# Altium schematic sheet PCB_Board4_schematic_2.SchDoc
size A; SheetNumber: 2; SheetTotal: 3
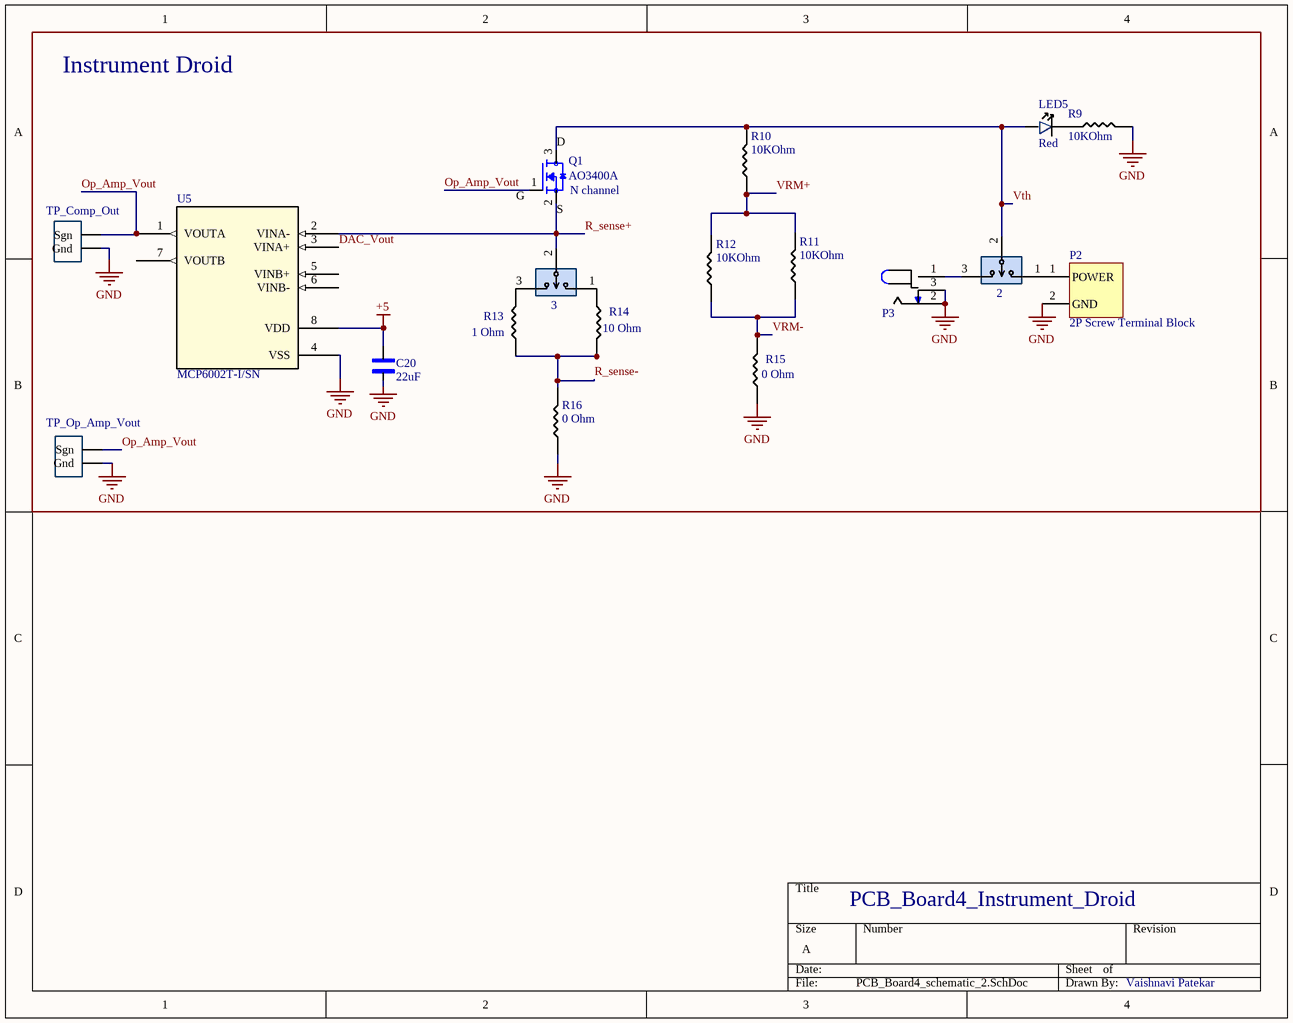
[diagram p0: PCB_Board4_schematic_2.SchDoc]

## Parts
2  PREC003SAAN-RC  [3_PIN_100mil]  (value not drawn)
3  PREC003SAAN-RC  [3_PIN_100mil]  (value not drawn)
C20  22uF  [1206_Passive_Capacitor]
LED5  Red  [LED_1206]
P2  2P Screw Terminal Block  [P_Terminal block 3.5mm-pitch]
P3  Power Jack  [Power_Jack]  (value not drawn)
Q1  AO3400A  value N channel  [N-MOSFET]
R9  value 10KOhm  [1206_Passive_Resitor]  (hidden comment: 10k)
R10  value 10KOhm  [1206_Passive_Resitor]  (hidden comment: 10k)
R11  value 10KOhm  [1206_Passive_Resitor]  (hidden comment: 10k)
R12  value 10KOhm  [1206_Passive_Resitor]  (hidden comment: 10k)
R13  1 Ohm  [1206_Passive_Resitor]
R14  10 Ohm  [1206_Passive_Resitor]
R15  0 Ohm  [1206_Passive_Resitor]
R16  0 Ohm  [1206_Passive_Resitor]
TP14  TP_Comp_Out  [TP10x_Probe]
TP15  TP_Op_Amp_Vout  [TP10x_Probe]
U5  MCP6002T-I/SN  [SOIC127P600X175-8N]

## Blocks framed on the sheet
Instrument Droid: 2 3 C20 LED5 P2 P3 Q1 R9-R16 TP14 TP15 U5

## Nets
+5: C20.1 U5.8(VDD)
GND: C20.2 P2.2(GND) P3.2 P3.3 R9.2 R15.1 R16.1 TP14.2(Gnd) TP15.2(Gnd) U5.4(VSS)
DAC_Vout: U5.3(VINA+)
Op_Amp_Vout: Q1.1(G) TP14.1(Sgn) TP15.1(Sgn) U5.1(VOUTA)
R_sense+: 3.2 Q1.2(S) U5.2(VINA-)
R_sense-: R13.1 R14.2 R16.2
VRM+: R10.1 R11.2 R12.2
VRM-: R11.1 R12.1 R15.2
Vth: 2.2 LED5.1 Q1.3(D) R10.2
Net2_1: 2.1 P2.1(POWER)
Net2_3: 2.3 P3.1
Net3_1: 3.1 R14.1
Net3_3: 3.3 R13.2
NetLED5_2: LED5.2 R9.1

Not connected (* = marked no-connect by the designer): U5 5(VINB+) 6(VINB-) 7(VOUTB)

## Notes on the sheet
- PCB_Board4_Instrument_Droid
- Vaishnavi Patekar

## Library data of the parts
2 3 = SW_3Pin_100mil_Switch: Connector Header Through Hole 3 position 0.100" (2.54mm); Value: CONN HEADER VERT 3POS 2.54MM; Digikey Link: https://www.digikey.com/product-detail/en/PREC003SAAN-RC/S1012EC-03-ND/2774851/?itemSeq=304982371; MFR Part #: PREC003SAAN-RC; Type: Extended; LCSC Part#: C49257
C20 = C_22uF_1206: 22uF ±10% 25V X5R 1206 Multilayer Ceramic Capacitors MLCC - SMD/SMT RoHS; MFR Part #: CL31A226KAHNNNE; Type: basic; LCSC Part#: C12891; Datasheet: https://datasheet.lcsc.com/lcsc/1811031514_Samsung-Electro-Mechanics-CL31A226KAHNNNE_C12891.pdf; Value: 22uF
LED5 = LED_RED_1206: Red 621~631nm 1206 Light Emitting Diodes (LED) RoHS; MFR Part #: 15-21/R6C-FQ1R1B/2T; Type: Extended; LCSC Part#: C93133; Datasheet: https://datasheet.lcsc.com/szlcsc/1811151241_Everlight-Elec-15-21-R6C-FQ1R1B-2T_C93133.pdf; Value: Red
P2 = P_Terminal block: Green Straight pin 3.5mm  pitch; P=3.5mm  Screw terminal ROHS; MFR Part #: KF350-3.5-2P; Manufacturer: Cixi Kefa Elec; LCSC Part#: C474892; DataSheet: https://datasheet.lcsc.com/lcsc/2001160007_Cixi-Kefa-Elec-KF350-3-5-2P_C474892.pdf
P3 = P_Power Jack: Power Barrel Connector Jack 2.10mm ID (0.083"), 5.50mm OD (0.217") Through Hole, Right Angle; MFR Part #: PJ-102A; Value: CONN PWR JACK 2X5.5MM SOLDER; Digikey Link: https://www.digikey.com/product-detail/en/PJ-102A/CP-102A-ND/275425/?itemSeq=304982367; LCSC Part#: C136744; Type: Extended
Q1 = Q_Nch_MOSFET: MOSFET N Trench 30V 5.7A 1.5V @ 250uA 26.5 m? @ 5.7A,10V SOT-23-3L RoHS; Type: Basic; LCSC Part#: C20917; Datasheet: https://datasheet.lcsc.com/szlcsc/Alpha-Omega-Semicon-AOS-AO3400A_C20917.pdf; MFR Part #: AO3400A
R9-R12 = R_10KOhm_1206: 10 kOhms ±5% 0.25W, 1/4W Chip Resistor 1206 (3216 Metric) Automotive AEC-Q200 Thick Film; MFR Part #: RMCF1206FT10K0; Digikey Link: https://www.digikey.com/en/products/detail/stackpole-electronics-inc/RMCF1206FT10K0/1759669; LCSC Part#: C17902; Type: Basic
R13 = R_1Ohm_1206: 1Ω ±5% 0.25W ±400ppm/℃ 1206 Chip Resistor - Surface Mount RoHS; MFR Part #: 1206W4J010JT5E; LCSC Part#: C1409; Datasheet: https://datasheet.lcsc.com/lcsc/1810301410_UNI-ROYAL-Uniroyal-Elec-1206W4J010JT5E_C1409.pdf; Type: Extended; Value: 1 Ohm
R14 = R_10Ohm_1206: CHIP RESISTOR - SURFACE MOUNT 0.1OHMS ±1% 1/4W 1206 ROHS; MFR Part #: 1206W4F100JT5E; Datasheet: https://datasheet.lcsc.com/szlcsc/Uniroyal-Elec-1206W4F100JT5E_C17903.pdf; LCSC Part#: C17903; Type: Basic; Value: 10 Ohm
R15 R16 = R_0Ohm_1206: CHIP RESISTOR - SURFACE MOUNT 0OHMS ±1% 1/4W 1206 ROHS; MFR Part #: 1206W4F0000T5E; Datasheet: https://datasheet.lcsc.com/szlcsc/Uniroyal-Elec-1206W4F0000T5E_C17888.pdf; LCSC Part#: C17888; Type: Basic; Mouser link: https://www.mouser.com/ProductDetail/Royalohm/1206W4F0000T5E?qs=e8oIoAS2J1Thbopin%252BsagQ%3D%3D; Value: 0 Ohm
TP14 TP15 = TP_10x_Probe: Test Point 300 mil centers
U5 = U_MCP6002T-I/SN: 0.6 V/us 2 1MHz 1.8V ~ 6V 100μA General Purpose SOIC-8_150mil  Operational Amplifier ROHS; Mfr: Microchip; MFR Part #: MCP6002T-I/SN; DataSheet: https://ww1.microchip.com/downloads/en/DeviceDoc/MCP6001-1R-1U-2-4-1-MHz-Low-Power-Op-Amp-DS20001733L.pdf; LCSC Part#: C7377; Type: Basic